# Altium schematic sheet VREG_RS485_VS.SchDoc
size A
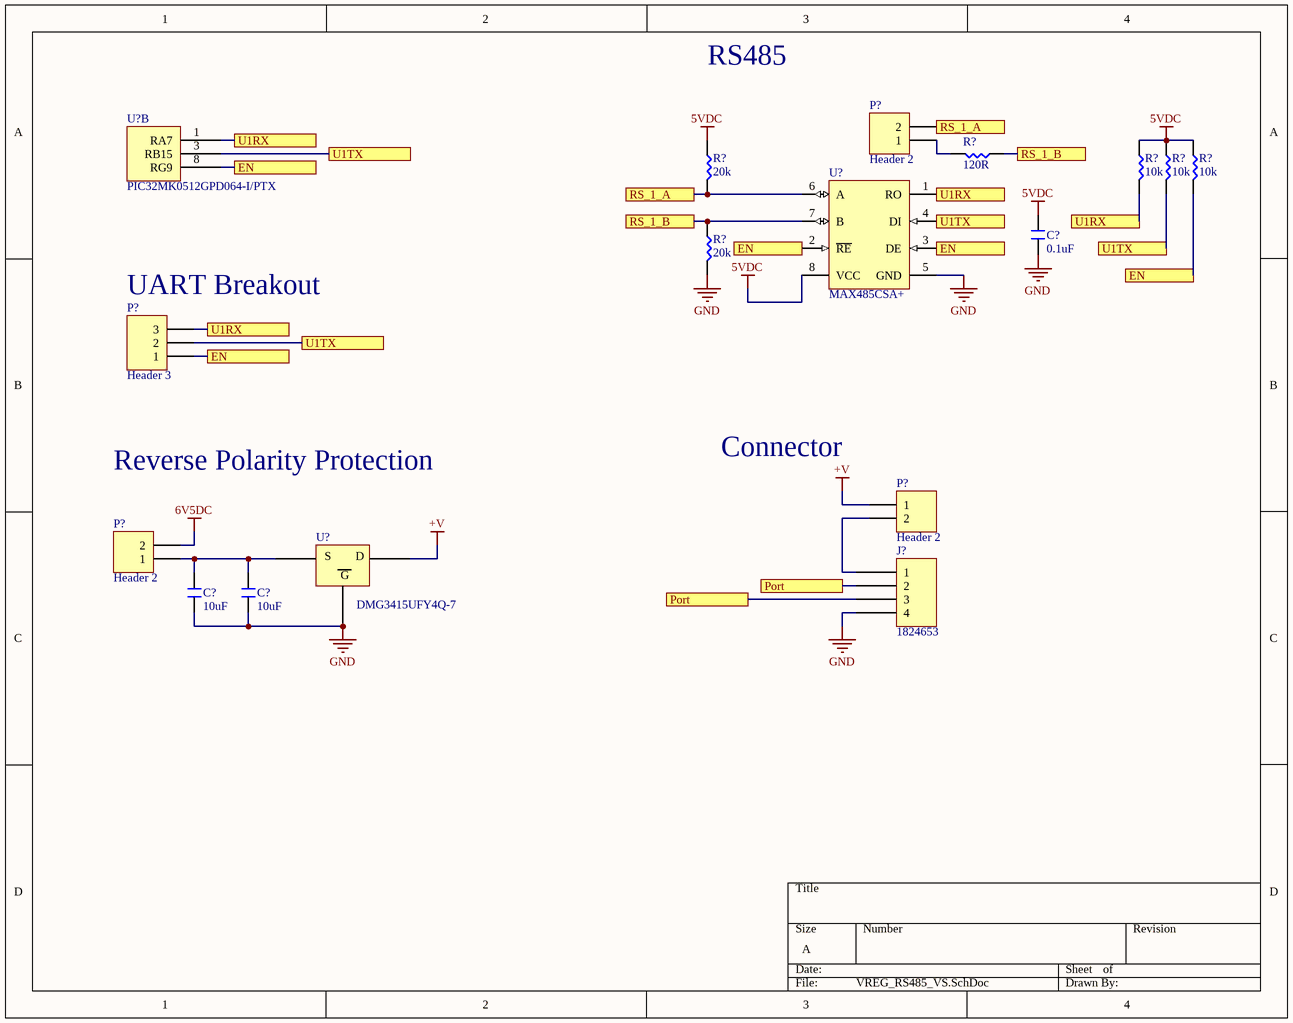
[diagram p0: VREG_RS485_VS.SchDoc]

## Parts
(Parts that share a designator on the sheet are numbered #1, #2 ... from top to bottom, then left to right.)
C?#1  0.1uF  [NonPolar-0402]
C?#2  10uF  [NonPolar-0805]
C?#3  10uF  [NonPolar-0805]
J?  1824653  [1824653]
P?#1  Header 2  [HDR1X2]
P?#2  Header 3  [HDR1X3]
P?#3  Header 2  [HDR1X2]
P?#4  Header 2  [HDR1X2]
R?#1  120R  [NonPolar-0603]
R?#2  20k  [NonPolar-0603]
R?#3  10k  [NonPolar-0603]
R?#4  10k  [NonPolar-0603]
R?#5  10k  [NonPolar-0603]
R?#6  20k  [NonPolar-0603]
U?#1  PIC32MK0512GPD064-I/PTX  [PIC32MK0512GPD064]  (part B of 2)
U?#2  MAX485CSA+  [MAXM-MAX485CSA+-8_M]
U?#3  DMG3415UFY4Q-7  [P_Channel_DMG3415UFY4Q-7_attempt1]

## Ports
EN, Port, RS_1_A, RS_1_B, U1RX, U1TX

## Nets
5VDC: C?#1.2 R?#2.2 R?#3.2 R?#4.2 R?#5.2 U?#2.8(VCC)
6V5DC: P?#4.2
+V: P?#3.1 U?#3.3
GND: C?#1.1 C?#2.1 C?#3.1 J?.4 R?#6.1 U?#2.5(GND) U?#3.1
EN: P?#2.1 R?#5.1 U?#1.8(RG9) U?#2.2(~{RE}) U?#2.3(DE) ; port EN
Port: J?.2 J?.3 ; port Port
RS_1_A: P?#1.2 R?#2.1 U?#2.6(A) ; port RS_1_A
RS_1_B: R?#1.2 R?#6.2 U?#2.7(B) ; port RS_1_B
U1RX: P?#2.3 R?#3.1 U?#1.1(RA7) U?#2.1(RO) ; port U1RX
U1TX: P?#2.2 R?#4.1 U?#1.3(RB15) U?#2.4(DI) ; port U1TX
NetC?#2_2: C?#2.2 C?#3.2 P?#4.1 U?#3.2
NetJ?_1: J?.1 P?#3.2
NetP?#1_1: P?#1.1 R?#1.1

## Notes on the sheet
- RS485
- (near P?#2) UART Breakout
- Reverse Polarity Protection
- Connector
- (in symbol P_Channel_DMG3415UFY4Q-7) S; D; G

## Library data of the parts
C?#1 = Cap - 0402
C?#2 C?#3 = Cap - 0805
P?#1 P?#3 P?#4 = Header 2: Header, 2-Pin; LatestRevisionDate: 17-Jul-2002; LatestRevisionNote: Re-released for DXP Platform.; Publisher: Altium Limited
P?#2 = Header 3: Header, 3-Pin; LatestRevisionDate: 17-Jul-2002; LatestRevisionNote: Re-released for DXP Platform.; Publisher: Altium Limited
R?#1-R?#6 = Res - 0603
U?#2 = CMP-2000-05211-1: Low-Power, Slew-Rate-Limited RS-485/RS-422 Transceiver, 4.75 to 5.25 V, 0 to 70 degC, 8-Pin SOIC, RoHS, Tape and Reel; Manufacturer: Maxim; No. of Receivers: 1; Transceiver Type: Differential; Supply Voltage Min: 4.75V; IC Generic Number: 485; IC Temperature Range: Commercial; No. of Pins: 8; Supply Voltage Range: 4.75Vto5.25V; Interface: RS-422/RS-485; Supply Voltage Max: 5.25V; Data Rate: 2.5Mbps; Line / Bus Driver / Receiver / Transceiver Type: CMOSDifferential; Supply Current: 500µA; Interface Type: RS422,RS485; Device Type: Transceiver; Manufacturer URL: http://www.maximintegrated.com/; Operating Temperature Range: 0degCto+70degC; Package / Case: SOIC; Digital IC Case Style: SOIC; Operating Temperature Max: 70degC; Device Marking: MAX485CSA+; Driver Case Style: SOIC; Datasheet Version: Rev. 8, 10/2003; Operating Temperature Min: 0degC; Datasheet URL: https://datasheet.ciiva.com/29306/170071-da-01-en-ic-max485csa-so8-29306144.pdf; Base Number: 485; No. of Drivers: 1; Logic Function Number: 485
U?#3 = P_Channel_DMG3415UFY4Q-7